# Altium schematic sheet Power.SchDoc
size A
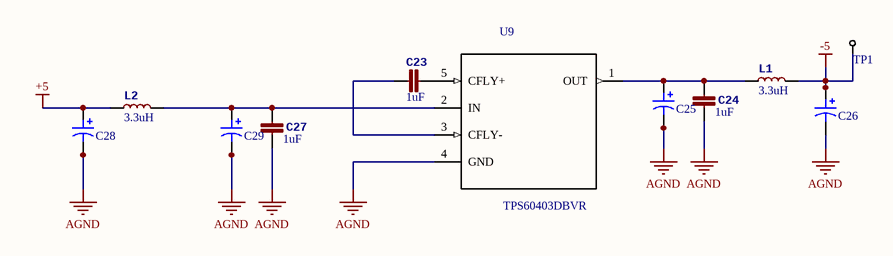
[diagram p0: Power.SchDoc]

## Parts
C23  value 1uF  [_0805]  (hidden comment: Cap)
C24  value 1uF  [_0805]  (hidden comment: Cap)
C25  100uF50V  [Cap electrolitic radial 10x20-5]  (value not drawn)
C26  100uF50V  [Cap electrolitic radial 10x20-5]  (value not drawn)
C27  value 1uF  [_0805]  (hidden comment: Cap)
C28  100uF50V  [Cap electrolitic radial 10x20-5]  (value not drawn)
C29  100uF50V  [Cap electrolitic radial 10x20-5]  (value not drawn)
L1  value 3.3uH  [_INDUCTOR-SMD-6.0mm]  (hidden comment: Inductor)
L2  value 3.3uH  [_INDUCTOR-SMD-6.0mm]  (hidden comment: Inductor)
TP1  Test Point  [Test Point]  (value not drawn)
U9  TPS60403DBVR  [*SOT95P280X145-5N]

## Nets
+5: C28.1 L2.1
-5: C26.1 L1.2 TP1.1(T)
AGND: C24.2 C25.2 C26.2 C27.2 C28.2 C29.2 U9.4(GND)
NetC23_1: C23.1 U9.3(CFLY-)
NetC23_2: C23.2 U9.5(CFLY+)
NetC24_1: C24.1 C25.1 L1.1 U9.1(OUT)
NetC27_1: C27.1 C29.1 L2.2 U9.2(IN)

## Library data of the parts
C23 C24 C27 = Cap_1
C25 C26 C28 C29 = Cap ELECTROLITIC TOTAL SIZE: Cap electrolitic radial; Designer: Abbas Basereh; Data: 16-12-2016; Part. No: *; VALUE: 100uF50V
U9 = TPS60403DBVR: 60mA Charge Pump Voltage Inverter with Fixed 250kHz Operation 5-SOT-23 -40 to 85; MF: Texas Instruments; Package: SOT-23-5 Texas Instruments; Price: None; SnapEDA_Link: https://www.snapeda.com/parts/TPS60403DBVR/Texas%20Instruments/view-part/?ref=snap; MP: TPS60403DBVR; Availability: Unavailable; Value: *